# Altium schematic sheet Sheet3.SchDoc
size 381 x 241 mm; SheetNumber: 1; SheetTotal: 1
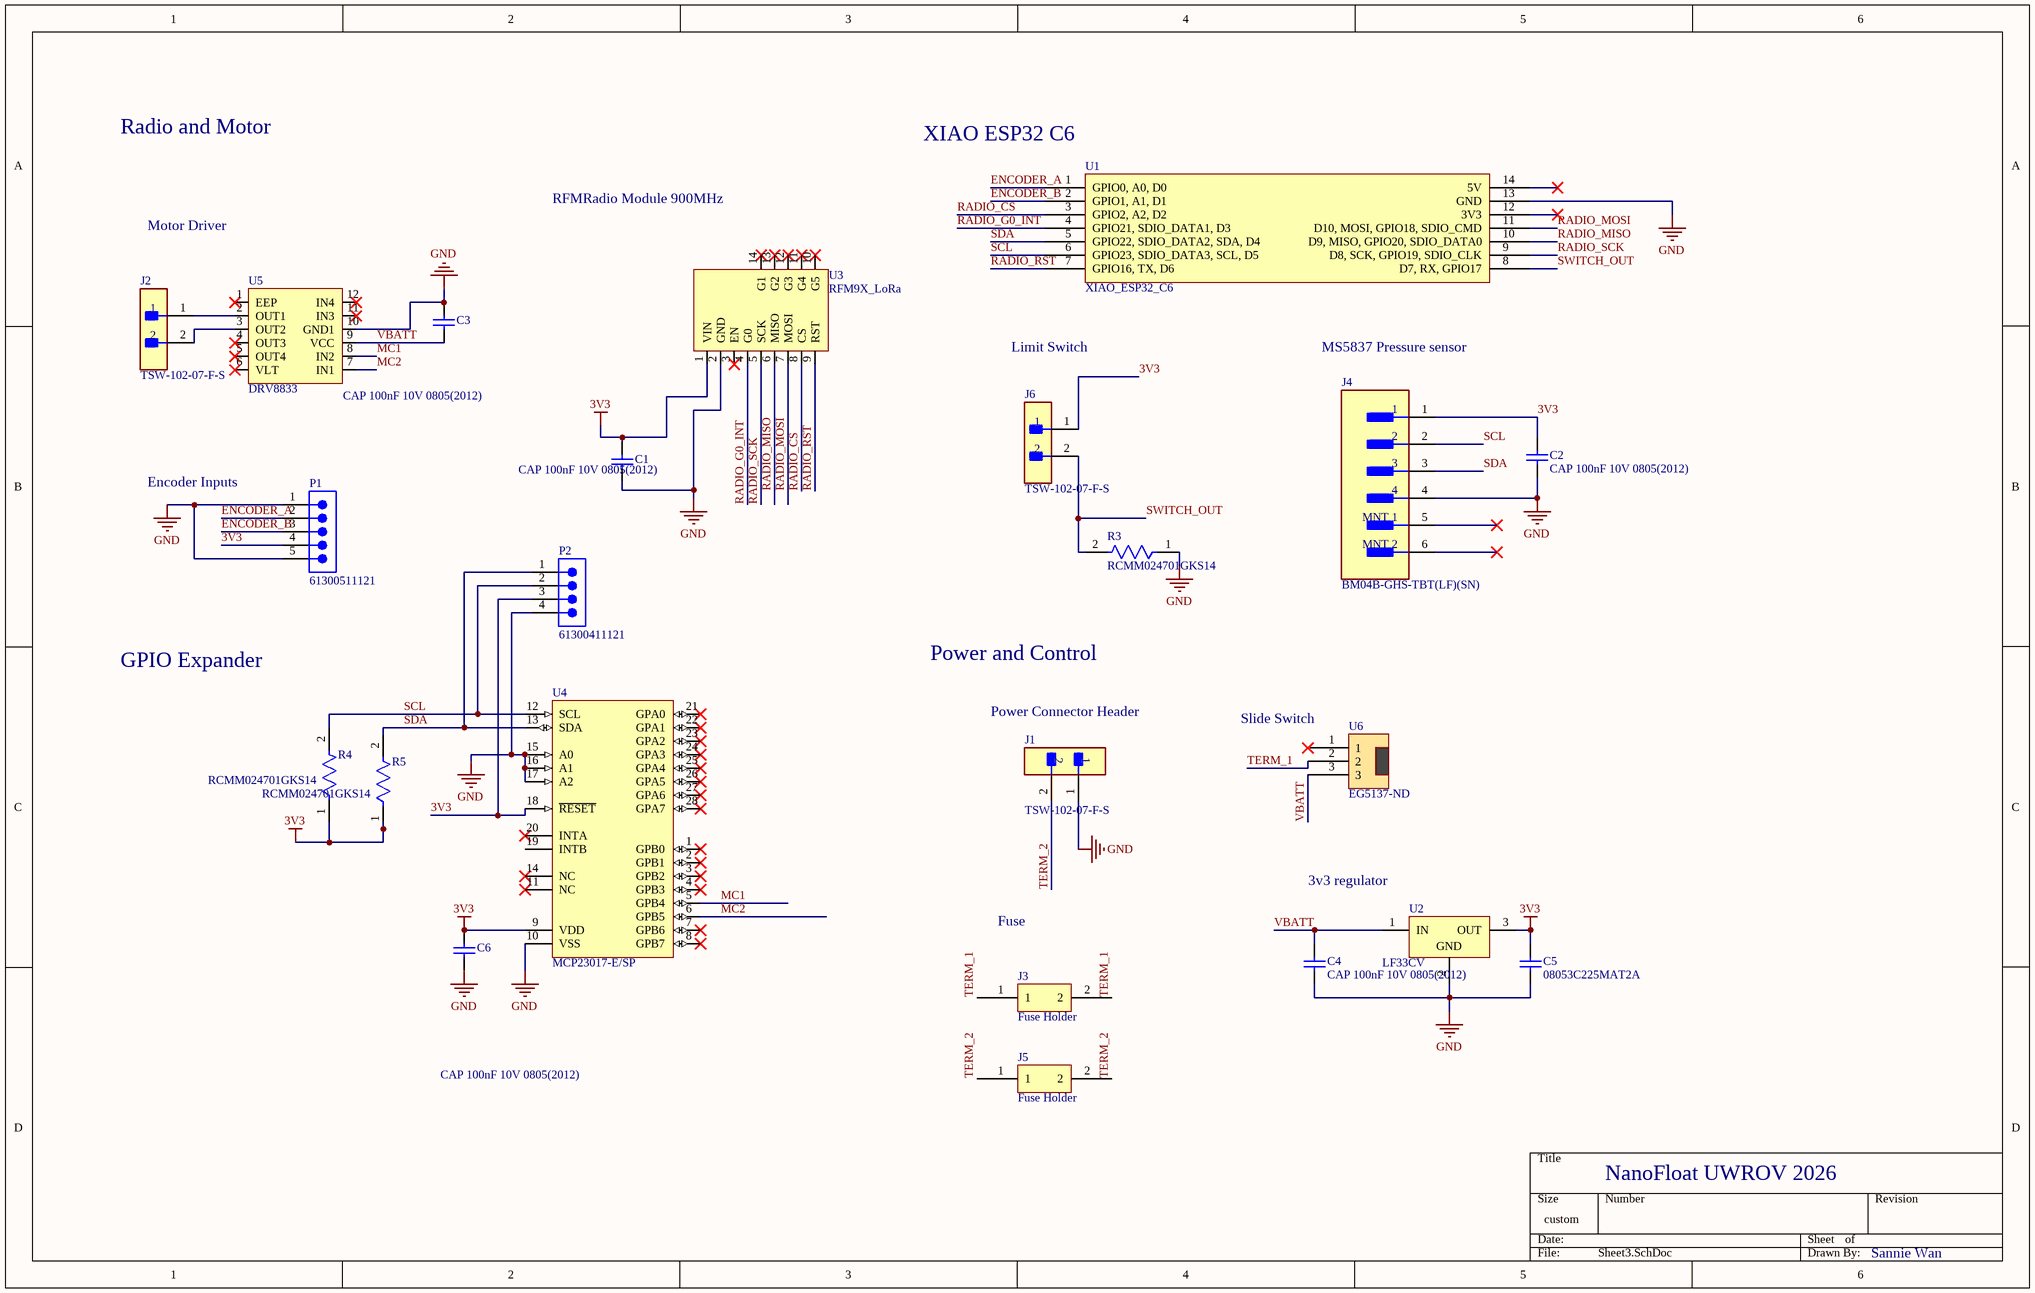
[diagram p0: Sheet3.SchDoc]

## Parts
C1  CAP 100nF 10V 0805(2012)  [CAPC0805(2012)100_M]
C2  CAP 100nF 10V 0805(2012)  [CAPC0805(2012)100_M]
C3  CAP 100nF 10V 0805(2012)  [CAPC0805(2012)100_M]
C4  CAP 100nF 10V 0805(2012)  [CAPC0805(2012)100_M]
C5  08053C225MAT2A  [CAPC2013X152X50ML20T25]
C6  CAP 100nF 10V 0805(2012)  [CAPC0805(2012)100_M]
J1  TSW-102-07-F-S  [FP-TSW-102-07-F-S-MFG]
J2  TSW-102-07-F-S  [FP-TSW-102-07-F-S-MFG]
J3  Fuse Holder  [FUSE_01110501Z]
J4  BM04B-GHS-TBT(LF)(SN)  [FP-BM04B-GHS-TBT_LF_SN-MFG]
J5  Fuse Holder  [FUSE_01110501Z]
J6  TSW-102-07-F-S  [FP-TSW-102-07-F-S-MFG]
P1  61300511121  [61300511121]
P2  61300411121  [61300411121]
R3  RCMM024701GKS14  [FP-RCMM02-MFG]
R4  RCMM024701GKS14  [FP-RCMM02-MFG]
R5  RCMM024701GKS14  [FP-RCMM02-MFG]
U1  XIAO_ESP32_C6  [MODULE_XIAO_ESP32C6]
U2  LF33CV  [TO220]
U3  RFM9X_LoRa  [RFM9X_LoRa]
U4  MCP23017-E/SP  [SPDIP300-SP28]
U5  DRV8833  [DRV8833 Motor Driver]
U6  EG5137-ND  [SW_500SSP1S2M2QEA]

## Nets
3V3: C1.2 C2.2 C5.2 C6.2 J4.1 J6.1 P1.4 P2.3 R4.1 R5.1 U2.3(OUT) U3.1(VIN) U4.9(VDD) U4.18(~{RESET})
GND: C1.1 C2.1 C3.2 C4.1 C5.1 C6.1 J1.1 J4.4 P1.1 P1.5 P2.4 R3.1 U1.13(GND) U2.2(GND) U3.2(GND) U4.10(VSS) U4.15(A0) U4.16(A1) U4.17(A2) U5.10(GND1)
ENCODER_A: P1.2 U1.1(GPIO0,_A0,_D0)
ENCODER_B: P1.3 U1.2(GPIO1,_A1,_D1)
MC1: U4.5(GPB4) U5.8(IN2)
MC2: U4.6(GPB5) U5.7(IN1)
RADIO_CS: U1.3(GPIO2,_A2,_D2) U3.8(CS)
RADIO_G0_INT: U1.4(GPIO21,_SDIO_DATA1,_D3) U3.4(G0)
RADIO_MISO: U1.10(D9,_MISO,_GPIO20,_SDIO_DATA0) U3.6(MISO)
RADIO_MOSI: U1.11(D10,_MOSI,_GPIO18,_SDIO_CMD) U3.7(MOSI)
RADIO_RST: U1.7(GPIO16,_TX,_D6) U3.9(RST)
RADIO_SCK: U1.9(D8,_SCK,_GPIO19,_SDIO_CLK) U3.5(SCK)
SCL: J4.2 P2.2 R4.2 U1.6(GPIO23,_SDIO_DATA3,_SCL,_D5) U4.12(SCL)
SDA: J4.3 P2.1 R5.2 U1.5(GPIO22,_SDIO_DATA2,_SDA,_D4) U4.13(SDA)
SWITCH_OUT: J6.2 R3.2 U1.8(D7,_RX,_GPIO17)
TERM_1: J3.1 J3.2 U6.2
TERM_2: J1.2 J5.1 J5.2
VBATT: C3.1 C4.2 U2.1(IN) U5.9(VCC) U6.3
NetJ2_1: J2.1 U5.2(OUT1)
NetJ2_2: J2.2 U5.3(OUT2)

Not connected (* = marked no-connect by the designer): J4 5(MNT_1)* 6(MNT_2)*; U1 12(3V3)* 14(5V)*; U3 3(EN)* 10(G5)* 11(G4)* 12(G3)* 13(G2)* 14(G1)*; U4 1(GPB0)* 2(GPB1)* 3(GPB2)* 4(GPB3)* 7(GPB6)* 8(GPB7)* 11(NC)* 14(NC)* 19(INTB) 20(INTA)* 21(GPA0)* 22(GPA1)* 23(GPA2)* 24(GPA3)* 25(GPA4)* 26(GPA5)* 27(GPA6)* 28(GPA7)*; U5 1(EEP)* 4(OUT3)* 5(OUT4)* 6(VLT)* 11(IN3)* 12(IN4)*; U6 1*

## Notes on the sheet
- Radio and Motor
- (near U1) XIAO ESP32 C6
- Motor Driver
- RFMRadio Module 900MHz
- Limit Switch
- MS5837 Pressure sensor
- Encoder Inputs
- GPIO Expander
- Power and Control
- Power Connector Header
- (near U6) Slide Switch
- (near U2) 3v3 regulator
- Fuse
- NanoFloat UWROV 2026
- Sannie Wan

## Library data of the parts
C1-C4 C6 = CMP-1036-04393-1: CAP 100nF 10V ±5% 0805 (2012 Metric) Thickness 1mm SMD; Tolerance: Â±5%; Case-EIA: 0805; Case-Metric: 2012; Rated Voltage: 10 V; Technology: SMT; Value: 100nF; Max Thickness: 1 mm
C5 = CMP-2007-04515-1: Manufacturer: AVX Interconnect / Elco; Part Number: 08053C225MAT2A
J1 J2 J6 = CMP-02766-001458-1: CONN HEADER VERT 2POS 2.54MM; Gender: Male; Max Current Rating: 7.6A; Number of Contacts: 2; Max Voltage Rating (AC): 550V; Orientation: Straight; Depth: 2.54mm; Series: TSW; Package Quantity: 1; Min Operating Temperature: -55°C; Max Operating Temperature: 125°C; Contact Type: Male Pin; Contact Shape: Square; Color: Black; Housing Color: Black; Connector Type: Header; Fastening Type: Pull; Radiation Hardening: No; Pitch: 2.54mm; Housing Material: Polyester; Mount: Through Hole; Number of Positions: 2; Number of Rows: 1; Contact Material: Bronze; Insulation Color: Black; Contact Finish - Mating: GOLD; Termination: Solder; Insulation Material: PBT; Length: 5.08mm; Flammability Rating: UL94 V-0; Contact Mating Length: 0.23inch; REACH SVHC: No SVHC; Contact Plating: Gold; RoHS Compliant: Yes; Packaging: Bulk
J3 J5 = Fuse_Holder
J4 = CMP-17439-000062-2: CONN HEADER SMD 4POS 1.25MM; Number of Positions: 4; Wire/Cable Gauge: 26AWG; Current Rating: 1A; Voltage Rating (AC): 50V; Gender: Male; Orientation: Straight; Max Operating Temperature: 85°C; Pitch: 1.25mm; Contact Plating: Tin; Number of Rows: 4; Series: GH; Min Operating Temperature: -25°C; REACH SVHC: No SVHC; Packaging: Cut Tape; Lead Free: Lead Free; Voltage Rating: 50V; Contact Material: Bronze; Number of Contacts: 4; Termination: Crimp; Case/Package: SMD/SMT; Housing Color: Natural; Housing Material: Nylon
P1 = CMP-1502-01068-4: THT Vertical Pin Header WR-PHD, Pitch 2.54 mm, Single Row, 5 pins; Number of Contacts: 5; Connector Type: Male Pin; Operating Supply Voltage: 250V; Contact Resistance: 20mΩ; Gender: Male; Pitch: 2.54mm; Current Rating: 3A; Min Operating Temperature: -40°C; Contact Material: Gold; Color: Black; RoHS: Compliant; Number of Rows: 1; Lead Free: Lead Free; Height: 8.89mm; Contact Plating: Gold; Number of Pins: 5; Orientation: Vertical; Voltage Rating: 250V; Packaging: Bulk; Number of Positions: 5; Max Operating Temperature: 105°C; Termination: Solder; Lead Pitch: 2.54mm; Contact Mating Length: 5.9944mm; Mount: Through Hole
P2 = CMP-1502-01064-4: THT Vertical Pin Header WR-PHD, Pitch 2.54 mm, Single Row, 4 pins; Connector Type: Male Pin; Gender: Male; Current Rating: 3A; Number of Positions: 4; Operating Supply Voltage: 250V; Contact Resistance: 20mΩ; Pitch: 2.54mm; Max Operating Temperature: 105°C; Mount: Through Hole; Contact Material: Gold; Contact Plating: Gold; Number of Contacts: 4; Orientation: Vertical; Packaging: Bulk; Contact Mating Length: 5.9944mm; Voltage Rating: 250V; Number of Rows: 1; Height: 8.89mm; Lead Free: Lead Free; Lead Pitch: 2.54mm; Number of Pins: 4; Color: Black; Min Operating Temperature: -40°C; RoHS: Compliant; Termination: Solder
R3-R5 = CMP-02408-000034-1: RES 4.7K OHM 2% 1/2W AXIAL; Temperature Coefficient: 100ppm/°C; Resistance: 4.7kR; RoHS Compliant: Yes; Contact Plating: Tin; Tolerance: 2%; Diameter: 2.5mm; Case/Package: Molded; Length: 6.5mm; Mount: Through Hole; Resistor Type: Metal Film
U1 = XIAO_ESP32_C6: seeed studio FCC ID:Z4T-XIAOESP32C6
U2 = CMP-0244-00432-1: 500mA, Very Low Drop (0.45V) Voltage Regulator, 3.3V, 3-Pin TO-220; PackageVersion: ver3.0; ComponentLink1URL: http://www.st.com; ComponentLink2URL: http://www.st.com/internet/com/TECHNICAL_RESOURCES/TECHNICAL_LITERATURE/DATASHEET/CD00000546.pdf; PackageDescription: TO, Thru-Hole, Vertical, Heatsink Mounted; 3 In-Line Leads; Pitch 2.54 mm; PackageReference: TO220; ComponentLink3Description: Package Specification; ComponentLink2Description: Datasheet; DatasheetVersion: 1/11/2010; ComponentLink3URL: http://www.st.com/internet/com/TECHNICAL_RESOURCES/TECHNICAL_LITERATURE/PACKAGE_INFORMATION/CD00004649.pdf; ComponentLink1Description: Manufacturer URL
U4 = CMP-0186-00081-2: 16-Bit I/O Expander with Serial Interface, 28-Pin SPDIP, Extended Temperature; RevisionNote: URLs added.; ComponentLink3Description: Package Specification; PackageVersion: revBB, Aug-2009; ComponentLink1Description: Manufacturer URL; DatasheetVersion: revB, Feb-2007; PackageDescription: 28-Lead Skinny Plastic Dual In-Line (SP) - 300 mil Body [SPDIP]; ComponentLink1URL: http://www.microchip.com/; PackageReference: SPDIP300-SP28; ComponentLink3URL: http://www.microchip.com/stellent/groups/techpub_sg/documents/packagingspec/en012702.pdf; ComponentLink2Description: Datasheet; ComponentLink2URL: http://ww1.microchip.com/downloads/en/DeviceDoc/21952b.pdf
U5 = DRV8833: Motor Driver 6.5V-45VDC In
U6 = 500SSP1S2M2QEA: Switch Slide ON None ON SPDT Extended Top Slide 5A 250VAC 28VDC PC Pins Thru-Hole; Manufacturer: E-Switch; Actuator Length: 7.239mm; Actuator Material: Nylon; Contact Current Rating: 2A; Contact Resistance: 10mΩ; Contact Voltage Rating (AC): 250V; Electrical Life: 30kcycles; Insulation Resistance: 1GΩ; Max Voltage Rating (DC): 28V; Number of Positions: 1; Sealable: EPOXY; Switch Function: On-On; Switch Travel: 2.16mm; Voltage Rating (AC): 120V; Supplier: DigiKey; Supplier Part Number: EG5137-ND; Manufacturer Part Number: 500SSP1S2M2QEA; RoHS: Compliant; Category: Slide Switches; Stock: 7980; Pricing: 1=3.29, 10=2.758, 25=2.556, 126=2.23468, 252=2.11369, 504=2.00373, 1008=1.90486, 2520=1.79075, 5040=1.71628 (USD); Contact Material: Copper; Contact Plating: Silver; Current Rating: 5A; Export Control Classification Number (ECCN) Code: EAR99; Housing Material: Stainless Steel; Harmonized Tariff Schedule (HTS) Code: 8536.50.70.00; Introduction Date: 2000-02-16; Length: 12.8524mm; Lifecycle Status: Production; Max Current Rating: 5A; Max Operating Temperature: 85°C; Mechanical Life: 30kcycles; Min Operating Temperature: -30°C; Mounting Technology: Through Hole; Orientation: Vertical; REACH SVHC: Yes; Termination: PC Pin; Throw Configuration: SPDT; Voltage Rating (DC): 28V; ComponentLink1URL: https://datasheet.octopart.com:443/500SSP1S2M2QEA-E-Switch-datasheet-41192586.pdf?src-supplier=element14+APAC; ComponentLink1Description: https://datasheet.octopart.com:443/500SSP1S2M2QEA-E-Switch-datasheet-41192586.pdf?src-supplier=element14+APAC; ComponentLink2URL: https://datasheet.octopart.com:443/500SSP1S2M2QEA-E-Switch-datasheet-156105959.pdf?src-supplier=Future+Electronics; ComponentLink2Description: https://datasheet.octopart.com:443/500SSP1S2M2QEA-E-Switch-datasheet-156105959.pdf?src-supplier=Future+Electronics; ComponentLink3URL: https://datasheet.octopart.com:443/500SSP1S2M2QEA-E-Switch-datasheet-169364037.pdf?src-supplier=New+Yorker+Electronics; ComponentLink3Description: https://datasheet.octopart.com:443/500SSP1S2M2QEA-E-Switch-datasheet-169364037.pdf?src-supplier=New+Yorker+Electronics; ComponentLink4URL: https://datasheet.octopart.com:443/500SSP1S2M2QEA-E-Switch-datasheet-33408909.pdf?src-supplier=Electro+Sonic; ComponentLink4Description: https://datasheet.octopart.com:443/500SSP1S2M2QEA-E-Switch-datasheet-33408909.pdf?src-supplier=Electro+Sonic